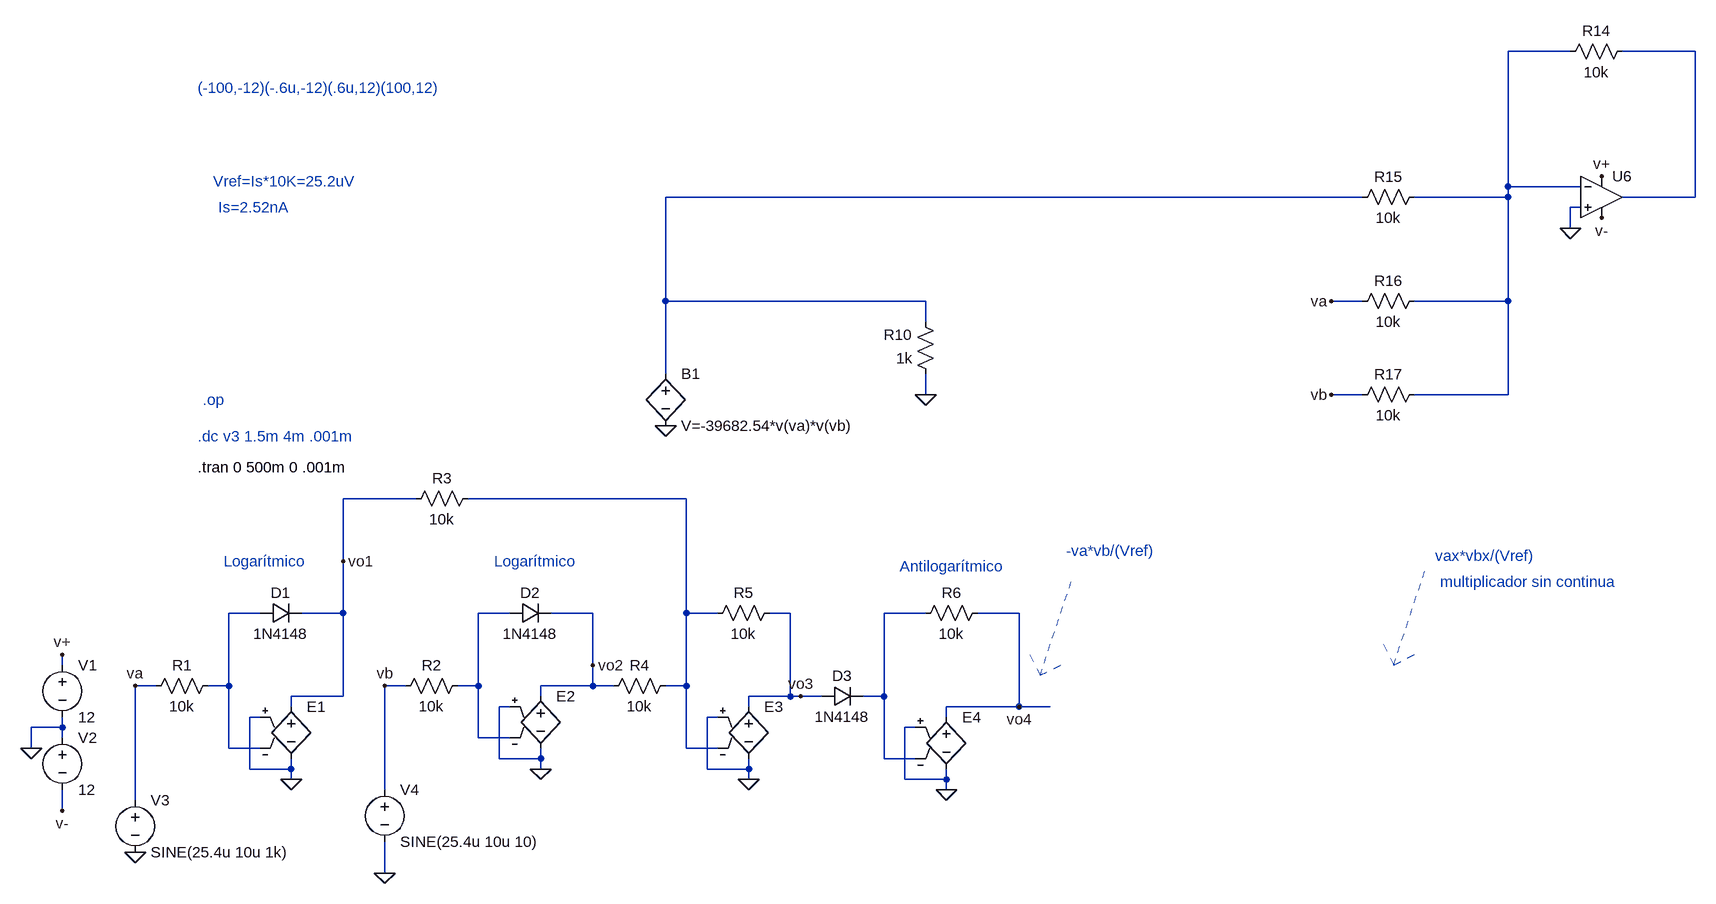
[diagram p0: schematic Multiplicador2.asc]
Multiplicador2.asc, the LTspice schematic file:
Version 4
SHEET 1 1588 680
WIRE 1296 -1200 1200 -1200
WIRE 1488 -1200 1376 -1200
WIRE 1200 -992 1200 -1200
WIRE 1312 -992 1200 -992
WIRE 976 -976 -96 -976
WIRE 1200 -976 1200 -992
WIRE 1200 -976 1056 -976
WIRE 1488 -976 1488 -1200
WIRE 1488 -976 1376 -976
WIRE 1312 -960 1296 -960
WIRE 1296 -928 1296 -960
WIRE -96 -816 -96 -976
WIRE 304 -816 -96 -816
WIRE 976 -816 928 -816
WIRE 1200 -816 1200 -976
WIRE 1200 -816 1056 -816
WIRE 304 -784 304 -816
WIRE -96 -704 -96 -816
WIRE 304 -672 304 -704
WIRE 976 -672 928 -672
WIRE 1200 -672 1200 -816
WIRE 1200 -672 1056 -672
WIRE -480 -512 -592 -512
WIRE -64 -512 -400 -512
WIRE -592 -416 -592 -512
WIRE -720 -336 -768 -336
WIRE -592 -336 -592 -416
WIRE -592 -336 -656 -336
WIRE -336 -336 -384 -336
WIRE -208 -336 -272 -336
WIRE -64 -336 -64 -512
WIRE -16 -336 -64 -336
WIRE 96 -336 64 -336
WIRE 304 -336 240 -336
WIRE 448 -336 384 -336
WIRE -1024 -256 -1024 -272
WIRE -208 -256 -208 -336
WIRE -880 -224 -912 -224
WIRE -768 -224 -768 -336
WIRE -768 -224 -800 -224
WIRE -496 -224 -528 -224
WIRE -384 -224 -384 -336
WIRE -384 -224 -416 -224
WIRE -208 -224 -208 -256
WIRE -208 -224 -288 -224
WIRE -176 -224 -208 -224
WIRE -64 -224 -64 -336
WIRE -64 -224 -96 -224
WIRE -592 -208 -592 -336
WIRE -592 -208 -672 -208
WIRE -288 -208 -288 -224
WIRE 96 -208 96 -336
WIRE 96 -208 32 -208
WIRE 112 -208 96 -208
WIRE 144 -208 112 -208
WIRE 240 -208 240 -336
WIRE 240 -208 208 -208
WIRE -672 -192 -672 -208
WIRE -336 -192 -352 -192
WIRE 32 -192 32 -208
WIRE 448 -192 448 -336
WIRE 448 -192 336 -192
WIRE 496 -192 448 -192
WIRE -720 -176 -736 -176
WIRE -16 -176 -32 -176
WIRE 336 -176 336 -192
WIRE -1024 -160 -1024 -176
WIRE -1024 -160 -1072 -160
WIRE 288 -160 272 -160
WIRE -1024 -144 -1024 -160
WIRE -384 -144 -384 -224
WIRE -336 -144 -384 -144
WIRE -1072 -128 -1072 -160
WIRE -768 -128 -768 -224
WIRE -720 -128 -768 -128
WIRE -64 -128 -64 -224
WIRE -16 -128 -64 -128
WIRE -352 -112 -352 -192
WIRE -288 -112 -288 -128
WIRE -288 -112 -352 -112
WIRE 240 -112 240 -208
WIRE 288 -112 240 -112
WIRE -736 -96 -736 -176
WIRE -672 -96 -672 -112
WIRE -672 -96 -736 -96
WIRE -288 -96 -288 -112
WIRE -32 -96 -32 -176
WIRE 32 -96 32 -112
WIRE 32 -96 -32 -96
WIRE -672 -80 -672 -96
WIRE 32 -80 32 -96
WIRE 272 -80 272 -160
WIRE 336 -80 336 -96
WIRE 336 -80 272 -80
WIRE -528 -64 -528 -224
WIRE 336 -64 336 -80
WIRE -912 -48 -912 -224
WIRE -1024 -32 -1024 -64
WIRE -528 64 -528 16
FLAG -1072 -128 0
FLAG -912 32 0
FLAG -528 64 0
FLAG -912 -224 va
FLAG -528 -224 vb
FLAG -96 -624 0
FLAG 304 -672 0
FLAG -1024 -272 v+
FLAG -1024 -32 v-
FLAG 1344 -1008 v+
FLAG 1344 -944 v-
FLAG 1296 -928 0
FLAG 928 -816 va
FLAG 928 -672 vb
FLAG -672 -80 0
FLAG -288 -96 0
FLAG 32 -80 0
FLAG 336 -64 0
FLAG -592 -416 vo1
FLAG -208 -256 vo2
FLAG 112 -208 vo3
FLAG 448 -192 vo4
SYMBOL diode -720 -320 R270
WINDOW 0 32 32 VTop 2
WINDOW 3 0 32 VBottom 2
SYMATTR InstName D1
SYMATTR Value 1N4148
SYMBOL voltage -1024 -272 R0
WINDOW 123 0 0 Left 2
WINDOW 39 0 0 Left 2
SYMATTR InstName V1
SYMATTR Value 12
SYMBOL voltage -1024 -160 R0
WINDOW 123 0 0 Left 2
WINDOW 39 0 0 Left 2
SYMATTR InstName V2
SYMATTR Value 12
SYMBOL res -784 -240 R90
WINDOW 0 0 56 VBottom 2
WINDOW 3 32 56 VTop 2
SYMATTR InstName R1
SYMATTR Value 10k
SYMBOL voltage -912 -64 R0
WINDOW 123 0 0 Left 2
WINDOW 39 0 0 Left 2
SYMATTR InstName V3
SYMATTR Value SINE(25.4u 10u 1k)
SYMBOL diode -336 -320 R270
WINDOW 0 32 32 VTop 2
WINDOW 3 0 32 VBottom 2
SYMATTR InstName D2
SYMATTR Value 1N4148
SYMBOL res -400 -240 R90
WINDOW 0 0 56 VBottom 2
WINDOW 3 32 56 VTop 2
SYMATTR InstName R2
SYMATTR Value 10k
SYMBOL voltage -528 -80 R0
WINDOW 123 0 0 Left 2
WINDOW 39 0 0 Left 2
SYMATTR InstName V4
SYMATTR Value SINE(25.4u 10u 10)
SYMBOL res 80 -352 R90
WINDOW 0 0 56 VBottom 2
WINDOW 3 32 56 VTop 2
SYMATTR InstName R5
SYMATTR Value 10k
SYMBOL diode 144 -192 R270
WINDOW 0 32 32 VTop 2
WINDOW 3 0 32 VBottom 2
SYMATTR InstName D3
SYMATTR Value 1N4148
SYMBOL res 400 -352 R90
WINDOW 0 0 56 VBottom 2
WINDOW 3 32 56 VTop 2
SYMATTR InstName R6
SYMATTR Value 10k
SYMBOL bv -96 -720 R0
SYMATTR InstName B1
SYMATTR Value V=-39682.54*v(va)*v(vb)
SYMBOL res 320 -688 R180
WINDOW 0 36 76 Left 2
WINDOW 3 36 40 Left 2
SYMATTR InstName R10
SYMATTR Value 1k
SYMBOL Opamps\\UniversalOpamp2 1344 -976 R0
SYMATTR InstName U6
SYMBOL res 1392 -1216 R90
WINDOW 0 0 56 VBottom 2
WINDOW 3 32 56 VTop 2
SYMATTR InstName R14
SYMATTR Value 10k
SYMBOL res 1072 -992 R90
WINDOW 0 0 56 VBottom 2
WINDOW 3 32 56 VTop 2
SYMATTR InstName R15
SYMATTR Value 10k
SYMBOL res 1072 -832 R90
WINDOW 0 0 56 VBottom 2
WINDOW 3 32 56 VTop 2
SYMATTR InstName R16
SYMATTR Value 10k
SYMBOL res 1072 -688 R90
WINDOW 0 0 56 VBottom 2
WINDOW 3 32 56 VTop 2
SYMATTR InstName R17
SYMATTR Value 10k
SYMBOL e -672 -208 R0
WINDOW 3 24 96 Invisible 2
SYMATTR Value (-100,-12)(-.6u,-12)(.6u,12)(100,12)
SYMATTR InstName E1
SYMATTR SpiceModel table
SYMBOL e -288 -224 R0
WINDOW 3 24 96 Invisible 2
SYMATTR Value (-100,-12)(-.6u,-12)(.6u,12)(100,12)
SYMATTR InstName E2
SYMATTR SpiceModel table
SYMBOL e 32 -208 R0
WINDOW 3 24 96 Invisible 2
SYMATTR Value (-100,-12)(-.6u,-12)(.6u,12)(100,12)
SYMATTR InstName E3
SYMATTR SpiceModel table
SYMBOL e 336 -192 R0
WINDOW 3 24 96 Invisible 2
SYMATTR Value (-100,-12)(-.6u,-12)(.6u,12)(100,12)
SYMATTR InstName E4
SYMATTR SpiceModel table
SYMBOL res -384 -528 R90
WINDOW 0 0 56 VBottom 2
WINDOW 3 32 56 VTop 2
SYMATTR InstName R3
SYMATTR Value 10k
SYMBOL res -80 -240 R90
WINDOW 0 0 56 VBottom 2
WINDOW 3 32 56 VTop 2
SYMATTR InstName R4
SYMATTR Value 10k
TEXT -816 -608 Left 2 ;.dc v3 1.5m 4m .001m
TEXT -816 -560 Left 2 !.tran 0 500m 0 .001m
TEXT -776 -416 Left 2 ;Logarítmico
TEXT -360 -416 Left 2 ;Logarítmico
TEXT 264 -408 Left 2 ;Antilogarítmico
TEXT 520 -432 Left 2 ;-va*vb/(Vref)
TEXT 1088 -424 Left 2 ;vax*vbx/(Vref)
TEXT 1096 -384 Left 2 ;multiplicador sin continua
TEXT -792 -1000 Left 2 ;Vref=Is*10K=25.2uV
TEXT -784 -960 Left 2 ;Is=2.52nA
TEXT -816 -1144 Left 2 ;(-100,-12)(-.6u,-12)(.6u,12)(100,12)
TEXT -808 -664 Left 2 ;.op
LINE Normal 480 -240 528 -384 2
LINE Normal 512 -256 480 -240 2
LINE Normal 480 -240 512 -256 2
LINE Normal 464 -272 480 -240 2
LINE Normal 1024 -256 1072 -400 2
LINE Normal 1056 -272 1024 -256 2
LINE Normal 1024 -256 1056 -272 2
LINE Normal 1008 -288 1024 -256 2

The netlist it stands for:
* Multiplicador2.asc
D1 N005 vo1 1N4148
V1 v+ 0 12
V2 0 v- 12
R1 N005 va 10k
V3 va 0 SINE(25.4u 10u 1k)
D2 N006 vo2 1N4148
R2 N006 vb 10k
V4 vb 0 SINE(25.4u 10u 10)
R5 vo3 N004 10k
D3 vo3 N007 1N4148
R6 vo4 N007 10k
B1 N003 0 V=-39682.54*v(va)*v(vb)
R10 0 N003 1k
XU6 0 N001 v+ v- N002 level.2 Avol=1Meg GBW=10Meg Slew=10Meg ilimit=25m rail=0 Vos=0 phimargin=45 en=0 enk=0 in=0 ink=0 Rin=500Meg  ; pins IN+ IN- V+ V- OUT
R14 N002 N001 10k
R15 N001 N003 10k
R16 N001 va 10k
R17 N001 vb 10k
E1 vo1 0 0 N005 table (-100,-12)(-.6u,-12)(.6u,12)(100,12)
E2 vo2 0 0 N006 table (-100,-12)(-.6u,-12)(.6u,12)(100,12)
E3 vo3 0 0 N004 table (-100,-12)(-.6u,-12)(.6u,12)(100,12)
E4 vo4 0 0 N007 table (-100,-12)(-.6u,-12)(.6u,12)(100,12)
R3 N004 vo1 10k
R4 N004 vo2 10k
.model D D
.lib standard.dio
* .dc v3 1.5m 4m .001m
.tran 0 500m 0 .001m
* Logarítmico
* Logarítmico
* Antilogarítmico
* -va*vb/(Vref)
* vax*vbx/(Vref)
* multiplicador sin continua
* Vref=Is*10K=25.2uV
* Is=2.52nA
* (-100,-12)(-.6u,-12)(.6u,12)(100,12)
* .op
.lib UniversalOpamps2.sub
.backanno
.end